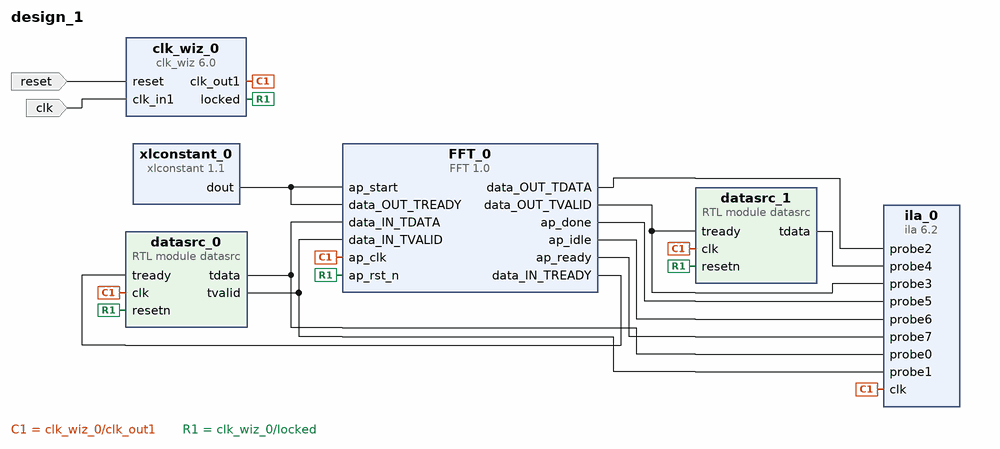
[diagram p0: block diagram of the top level]
# Vivado block design design_1, xc7z010clg400-1, Vivado 2018.2
create_bd_design design_1

create_bd_port -dir I -type rst reset
set_property -dict {CONFIG.POLARITY ACTIVE_HIGH} [get_bd_ports reset]
create_bd_port -dir I -type clk clk
set_property -dict {CONFIG.FREQ_HZ 125000000 CONFIG.PHASE 0.000} [get_bd_ports clk]

create_bd_cell -type ip -vlnv xilinx.com:hls:FFT:1.0 FFT_0
create_bd_cell -type ip -vlnv xilinx.com:ip:clk_wiz:6.0 clk_wiz_0
set_property -dict {CONFIG.USE_BOARD_FLOW true CONFIG.CLK_IN1_BOARD_INTERFACE sys_clock} [get_bd_cells clk_wiz_0]
create_bd_cell -type ip -vlnv xilinx.com:ip:xlconstant:1.1 xlconstant_0
create_bd_cell -type module -reference datasrc datasrc_0
create_bd_cell -type module -reference datasrc datasrc_1
set_property -dict {CONFIG.infile out_hex.mem} [get_bd_cells datasrc_1]
create_bd_cell -type ip -vlnv xilinx.com:ip:ila:6.2 ila_0
set_property -dict [list \
  CONFIG.C_PROBE4_WIDTH 32 \
  CONFIG.C_PROBE2_WIDTH 32 \
  CONFIG.C_PROBE0_WIDTH 32 \
  CONFIG.C_NUM_OF_PROBES 8 \
  CONFIG.C_ENABLE_ILA_AXI_MON false \
  CONFIG.C_MONITOR_TYPE Native \
] [get_bd_cells ila_0]

# ---- connections ----

connect_bd_net -net reset_rtl_1 [get_bd_ports reset] [get_bd_pins clk_wiz_0/reset]
connect_bd_net -net sys_clock_1 [get_bd_ports clk] [get_bd_pins clk_wiz_0/clk_in1]
connect_bd_net [get_bd_pins clk_wiz_0/clk_out1] \
  [get_bd_pins FFT_0/ap_clk] [get_bd_pins datasrc_0/clk] [get_bd_pins datasrc_1/clk] [get_bd_pins ila_0/clk]
connect_bd_net [get_bd_pins clk_wiz_0/locked] [get_bd_pins FFT_0/ap_rst_n] [get_bd_pins datasrc_1/resetn] [get_bd_pins datasrc_0/resetn]
connect_bd_net [get_bd_pins xlconstant_0/dout] [get_bd_pins FFT_0/ap_start] [get_bd_pins FFT_0/data_OUT_TREADY]
connect_bd_net [get_bd_pins datasrc_0/tdata] [get_bd_pins FFT_0/data_IN_TDATA] [get_bd_pins ila_0/probe0]
connect_bd_net [get_bd_pins datasrc_0/tvalid] [get_bd_pins FFT_0/data_IN_TVALID] [get_bd_pins ila_0/probe1]
connect_bd_net [get_bd_pins FFT_0/data_IN_TREADY] [get_bd_pins datasrc_0/tready]
connect_bd_net [get_bd_pins FFT_0/data_OUT_TDATA] [get_bd_pins ila_0/probe2]
connect_bd_net [get_bd_pins FFT_0/data_OUT_TVALID] [get_bd_pins ila_0/probe3] [get_bd_pins datasrc_1/tready]
connect_bd_net [get_bd_pins datasrc_1/tdata] [get_bd_pins ila_0/probe4]
connect_bd_net [get_bd_pins FFT_0/ap_done] [get_bd_pins ila_0/probe5]
connect_bd_net [get_bd_pins FFT_0/ap_idle] [get_bd_pins ila_0/probe6]
connect_bd_net [get_bd_pins FFT_0/ap_ready] [get_bd_pins ila_0/probe7]

validate_bd_design
save_bd_design
